# Altium schematic sheet NBM.SchDoc
size A; SheetNumber: 2; SheetTotal: 2
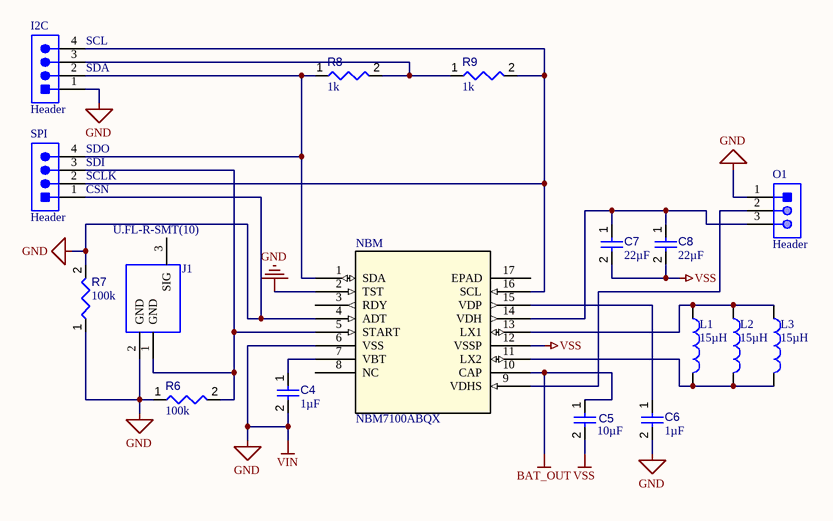
[diagram p0: NBM.SchDoc]

## Parts
C4  value 1µF  [FP-GRM155-0_1-IPC_C]  (hidden comment: GRM155Z71A105KE01D)
C5  value 10µF  [FP-GRM155-0_2-IPC_A]  (hidden comment: GRM155R60J106ME44D)
C6  value 1µF  [FP-GRM155-0_1-IPC_C]  (hidden comment: GRM155Z71A105KE01D)
C7  value 22µF  [FP-GRM158-0_2-MFG]  (hidden comment: GRM158R61A226ME15D)
C8  value 22µF  [FP-GRM158-0_2-MFG]  (hidden comment: GRM158R61A226ME15D)
I2C  Header  [JST-S4B-XH-A(LF)(SN)_V]
J1  U.FL-R-SMT(10)  [HRS-U.FL-R-SMT_V]
L1  value 15µH  [FP-MLZ1608-IPC_C]  (hidden comment: MLZ1608N150LTD25)
L2  value 15µH  [FP-MLZ1608-IPC_C]  (hidden comment: MLZ1608N150LTD25)
L3  value 15µH  [FP-MLZ1608-IPC_C]  (hidden comment: MLZ1608N150LTD25)
NBM  NBM7100ABQX  [DHVQFN16_NEX]
O1  Header  [JST-S3B-XH-A(LF)(SN)_V]
R6  value 100k  [RESC1005X40X25ML05T05]  (hidden comment: Resistor 100k +/-1% 0402 63 mW)
R7  value 100k  [RESC1005X40X25ML05T05]  (hidden comment: Resistor 100k +/-1% 0402 63 mW)
R8  value 1k  [RESC1005X40X25ML10T10]  (hidden comment: Resistor 1k +/-5% 0402 63 mW)
R9  value 1k  [RESC1005X40X25ML10T10]  (hidden comment: Resistor 1k +/-5% 0402 63 mW)
SPI  Header  [JST-S4B-XH-A(LF)(SN)_V]

## Nets
BAT_OUT: C5.1 NBM.10(CAP)
GND: C4.2 C6.2 I2C.1 J1.2(GND) NBM.2(TST) NBM.4(ADT) NBM.6(VSS) O1.1 R6.1 R7.1 R7.2 SPI.1  [also labelled VIN]
VSS: C5.2 C7.2 C8.2 NBM.12(VSSP)
NetC4_1: C4.1 NBM.7(VBT)
NetC6_1: C6.1 NBM.15(VDP)
NetC7_1: C7.1 C8.1 NBM.14(VDH) O1.3
NetI2C_2: I2C.2 NBM.1(SDA) R8.1 SPI.4
NetI2C_3: I2C.3 R8.2 R9.1
NetI2C_4: I2C.4 NBM.16(SCL) R9.2 SPI.2
NetJ1_1: J1.1(GND) NBM.5(START) R6.2 SPI.3
NetL1_1: L1.1 L2.1 L3.1 NBM.13(LX1)
NetL1_2: L1.2 L2.2 L3.2 NBM.11(LX2)
NetNBM_9: NBM.9(VDHS) O1.2

Not connected (* = marked no-connect by the designer): J1 3(SIG); NBM 3(RDY) 8(NC) 17(EPAD)

## Notes on the sheet
- (near I2C) SCL
- (near I2C) SDA
- (near SPI) SCLK
- (near SPI) SDI
- (near SPI) SDO
- (near SPI) CSN

## Library data of the parts
C4 C6 = CMP-001-00087-1: Ceramic Capacitor, Multilayer, Ceramic, 10V, 10% +Tol, 10% -Tol, X7R, 15% TC, 1uF, Surface Mount, 0402; Case/Package: 0402; RoHS Compliant: Yes; Max Operating Temperature: 125°C; Capacitor Type: Ceramic; Pins: 2; Min Operating Temperature: -55°C; Mounting Technology: Surface Mount
C5 = CMP-001-00089-1: Ceramic Capacitor, Multilayer, Ceramic, 6.3V, 20% +Tol, 20% -Tol, X5R, 15% TC, 10uF, Surface Mount, 0402; Mounting Technology: Surface Mount; Capacitor Type: Ceramic; RoHS Compliant: Yes; Pins: 2; Max Operating Temperature: 85°C; Min Operating Temperature: -55°C; Case/Package: 0402
C7 C8 = CMP-001-00090-1: Ceramic Capacitor, Multilayer, Ceramic, 10V, 20% +Tol, 20% -Tol, X5R, 15% TC, 22uF, Surface Mount, 0402; RoHS Compliant: Yes
I2C SPI = CMP-002-00034-2: Male Header, Pitch 2.5 mm, 1 x 4 Position, Height 6.1 mm, Tail Length 3.4 mm, -25 to 85 degC, RoHS, Bulk; Manufacturer: JST; Manufacturer URL: http://www.jst.com/home2.html; RoHS Compliant: Unknown; Gender: Male; Min Operating Temperature: -25°C; Datasheet URL: http://www.jst-mfg.com/product/pdf/eng/eXH.pdf; Case/Package: S4B-XH-A(LF)(SN); Datasheet Version: May-16; Mounting Technology: TH; Package Reference: S4B-XH-A(LF)(SN); Max Operating Temperature: 85°C; Package Description: XH Series Disconnectable Crimp Style Connector, Pitch 2.5 mm, 1 x 4 Position, Height 6.1 mm, Tail Length 3.4 mm; Connector Type: Header
J1 = CMP-002-00035-2: Ultra Small Surface Mount Coaxial Connector, 50 Ohm, -40 to 90 degC, 3-Pin SMD, RoHS, Tape and Reel; Manufacturer: Hirose Electric; Impedance: 50Ohm; Connector Type: RF&Coax; RoHS Compliant: True; Datasheet Version: Aug-16; Contact Material: Brass; Packaging: TapeandReel; Mounting Technology: SM; Package Description: 3-Pin Surface Mount Device, Body 2.6 x 2.6 mm; Max Operating Temperature: 90°C; Datasheet URL: https://www.hirose.com/product/en/download_file/key_name/U.FL/category/Catalog/doc_file_id/31697/?file_category_id=4&item_id=15&is_series=1; Package Reference: U.FL-R-SMT; Contact Plating: Gold; Min Operating Temperature: -40°C; Fastening Type: Snap; Package Quantity: 2500; Resistance: 50Ohm; Manufacturer URL: https://www.hirose.com; Case/Package: U.FL-R-SMT
L1-L3 = CMP-006-00022-1: General Purpose Inductor, 15uH, 20%, 1 Element, Ferrite-Core, SMD, 0603
NBM = NBM7100ABQX: No Description Available; Mfr_Name: Nexperia; Type: DEV; Copyright: Copyright (C) 2023 Ultra Librarian. All rights reserved.; Manufacturer_Part_Number: NBM7100ABQX; RefDes: RefDes
O1 = CMP-002-00033-2: Male Header, Pitch 2.5 mm, 1 x 3 Position, Height 6.1 mm, Tail Length 3.4 mm, -25 to 85 degC, RoHS, Bulk, name S3B-XH-A(LF)(SN); Manufacturer: JST; Package Description: Male Header, Pitch 2.5 mm, 1 x 3 Position, Height 6.1 mm, Tail Length 3.4 mm; Manufacturer URL: http://www.jst.com/home2.html; Datasheet URL: http://www.jst-mfg.com/product/pdf/eng/eXH.pdf; RoHS Compliant: Unknown; Connector Type: Header; Package Reference: S3B-XH-A(LF)(SN); Gender: Male; Case/Package: S3B-XH-A(LF)(SN); Mounting Technology: TH; Max Operating Temperature: 85°C; Min Operating Temperature: -25°C; Datasheet Version: May-16
R6 R7 = CMP-009-00021-5: Chip Resistor, 100 KOhm, +/- 1%, 0.063 W, -55 to 155 degC, 0402 (1005 Metric); Voltage Rating: 50V; Power: 63mW; Pins: 2; Tolerance: 1%; Max Operating Temperature: 155°C; Case/Package: 0402; Min Operating Temperature: -55°C; Mounting Technology: SM; RoHS Compliant: True
R8 R9 = CMP-009-00013-5: Chip Resistor, 1 KOhm, +/- 5%, 0.063 W, -55 to 155 degC, 0402 (1005 Metric); Power: 63mW; Tolerance: 5%; Case/Package: 0402; Mounting Technology: SM; Min Operating Temperature: -55°C; Pins: 2; Max Operating Temperature: 155°C; RoHS Compliant: True